# Altium schematic sheet V1.0.SchDoc
size 76 x 63 mm
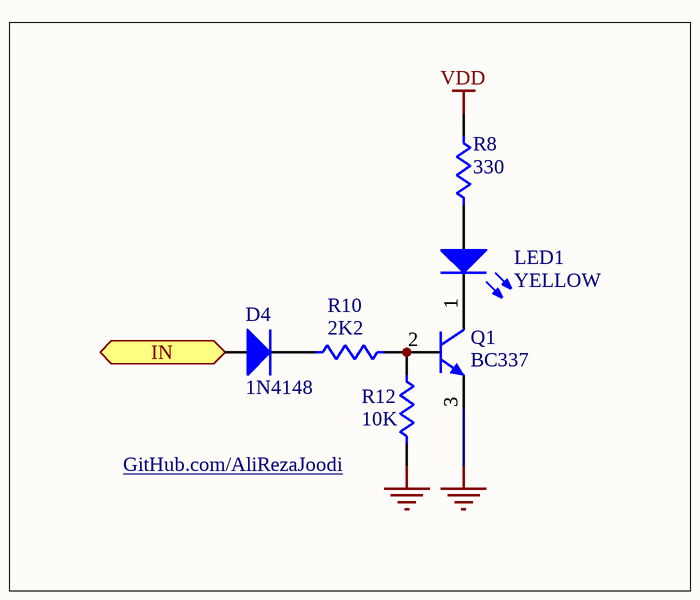
[diagram p0: V1.0.SchDoc]

## Parts
D4  1N4148  [DIODE0.4_Glass]
LED1  YELLOW  [LED-5mm_Red]
Q1  BC337  [TO92C]
R8  330  [AXIAL-0.4]
R10  2K2  [AXIAL-0.4]
R12  10K  [AXIAL-0.4]

## Ports
IN (in)

## Nets
GND: Q1.3(E) R12.2
VDD: R8.2
IN: D4.1(A) ; port IN
NetD4_2: D4.2(K) R10.2
NetLED1_1: LED1.1(A) R8.1
NetLED1_2: LED1.2(K) Q1.1(C)
NetQ1_2: Q1.2(B) R10.1 R12.1

## Notes on the sheet
- (near R12) GitHub.com/AliRezaJoodi

## Library data of the parts
D4 = Diode: Default Diode; Manufacturer: Generic Components; Class I: Discrete; Class II: Diode - Switching; Published: 8-Jun-2000; Revision: July-2002: Re-released for DXP Platform.; Publisher: Altium Limited
LED1 = LED: Typical INFRARED GaAs LED; Manufacturer: Generic Components; Class I: Optoelectronic; Published: 8-Jun-2000; Revision: July-2002: Re-released for DXP Platform.; Publisher: Altium Limited; Class II: LED
Q1 = NPN: NPN Bipolar Transistor; Manufacturer: Generic Components; Class I: Discrete; Class II: BJT - Low Power; Published: 8-Jun-2000; Revision: July-2002: Re-released for DXP Platform.; Publisher: Altium Limited
R8 R10 R12 = Res1: Resistor; Manufacturer: Generic Components; Class I: Passive; Published: 8-Jun-2000; Revision: July-2002: Re-released for DXP Platform.; Publisher: Altium Limited; Class II: Resistor